# EasyEDA schematic TSOP Module.json

## Sheets
1 Circuit 1: TITLE: Sheet_1; REV: 1.0; Date: 2023-03-30; Sheet: 1/1; Company: Your Company
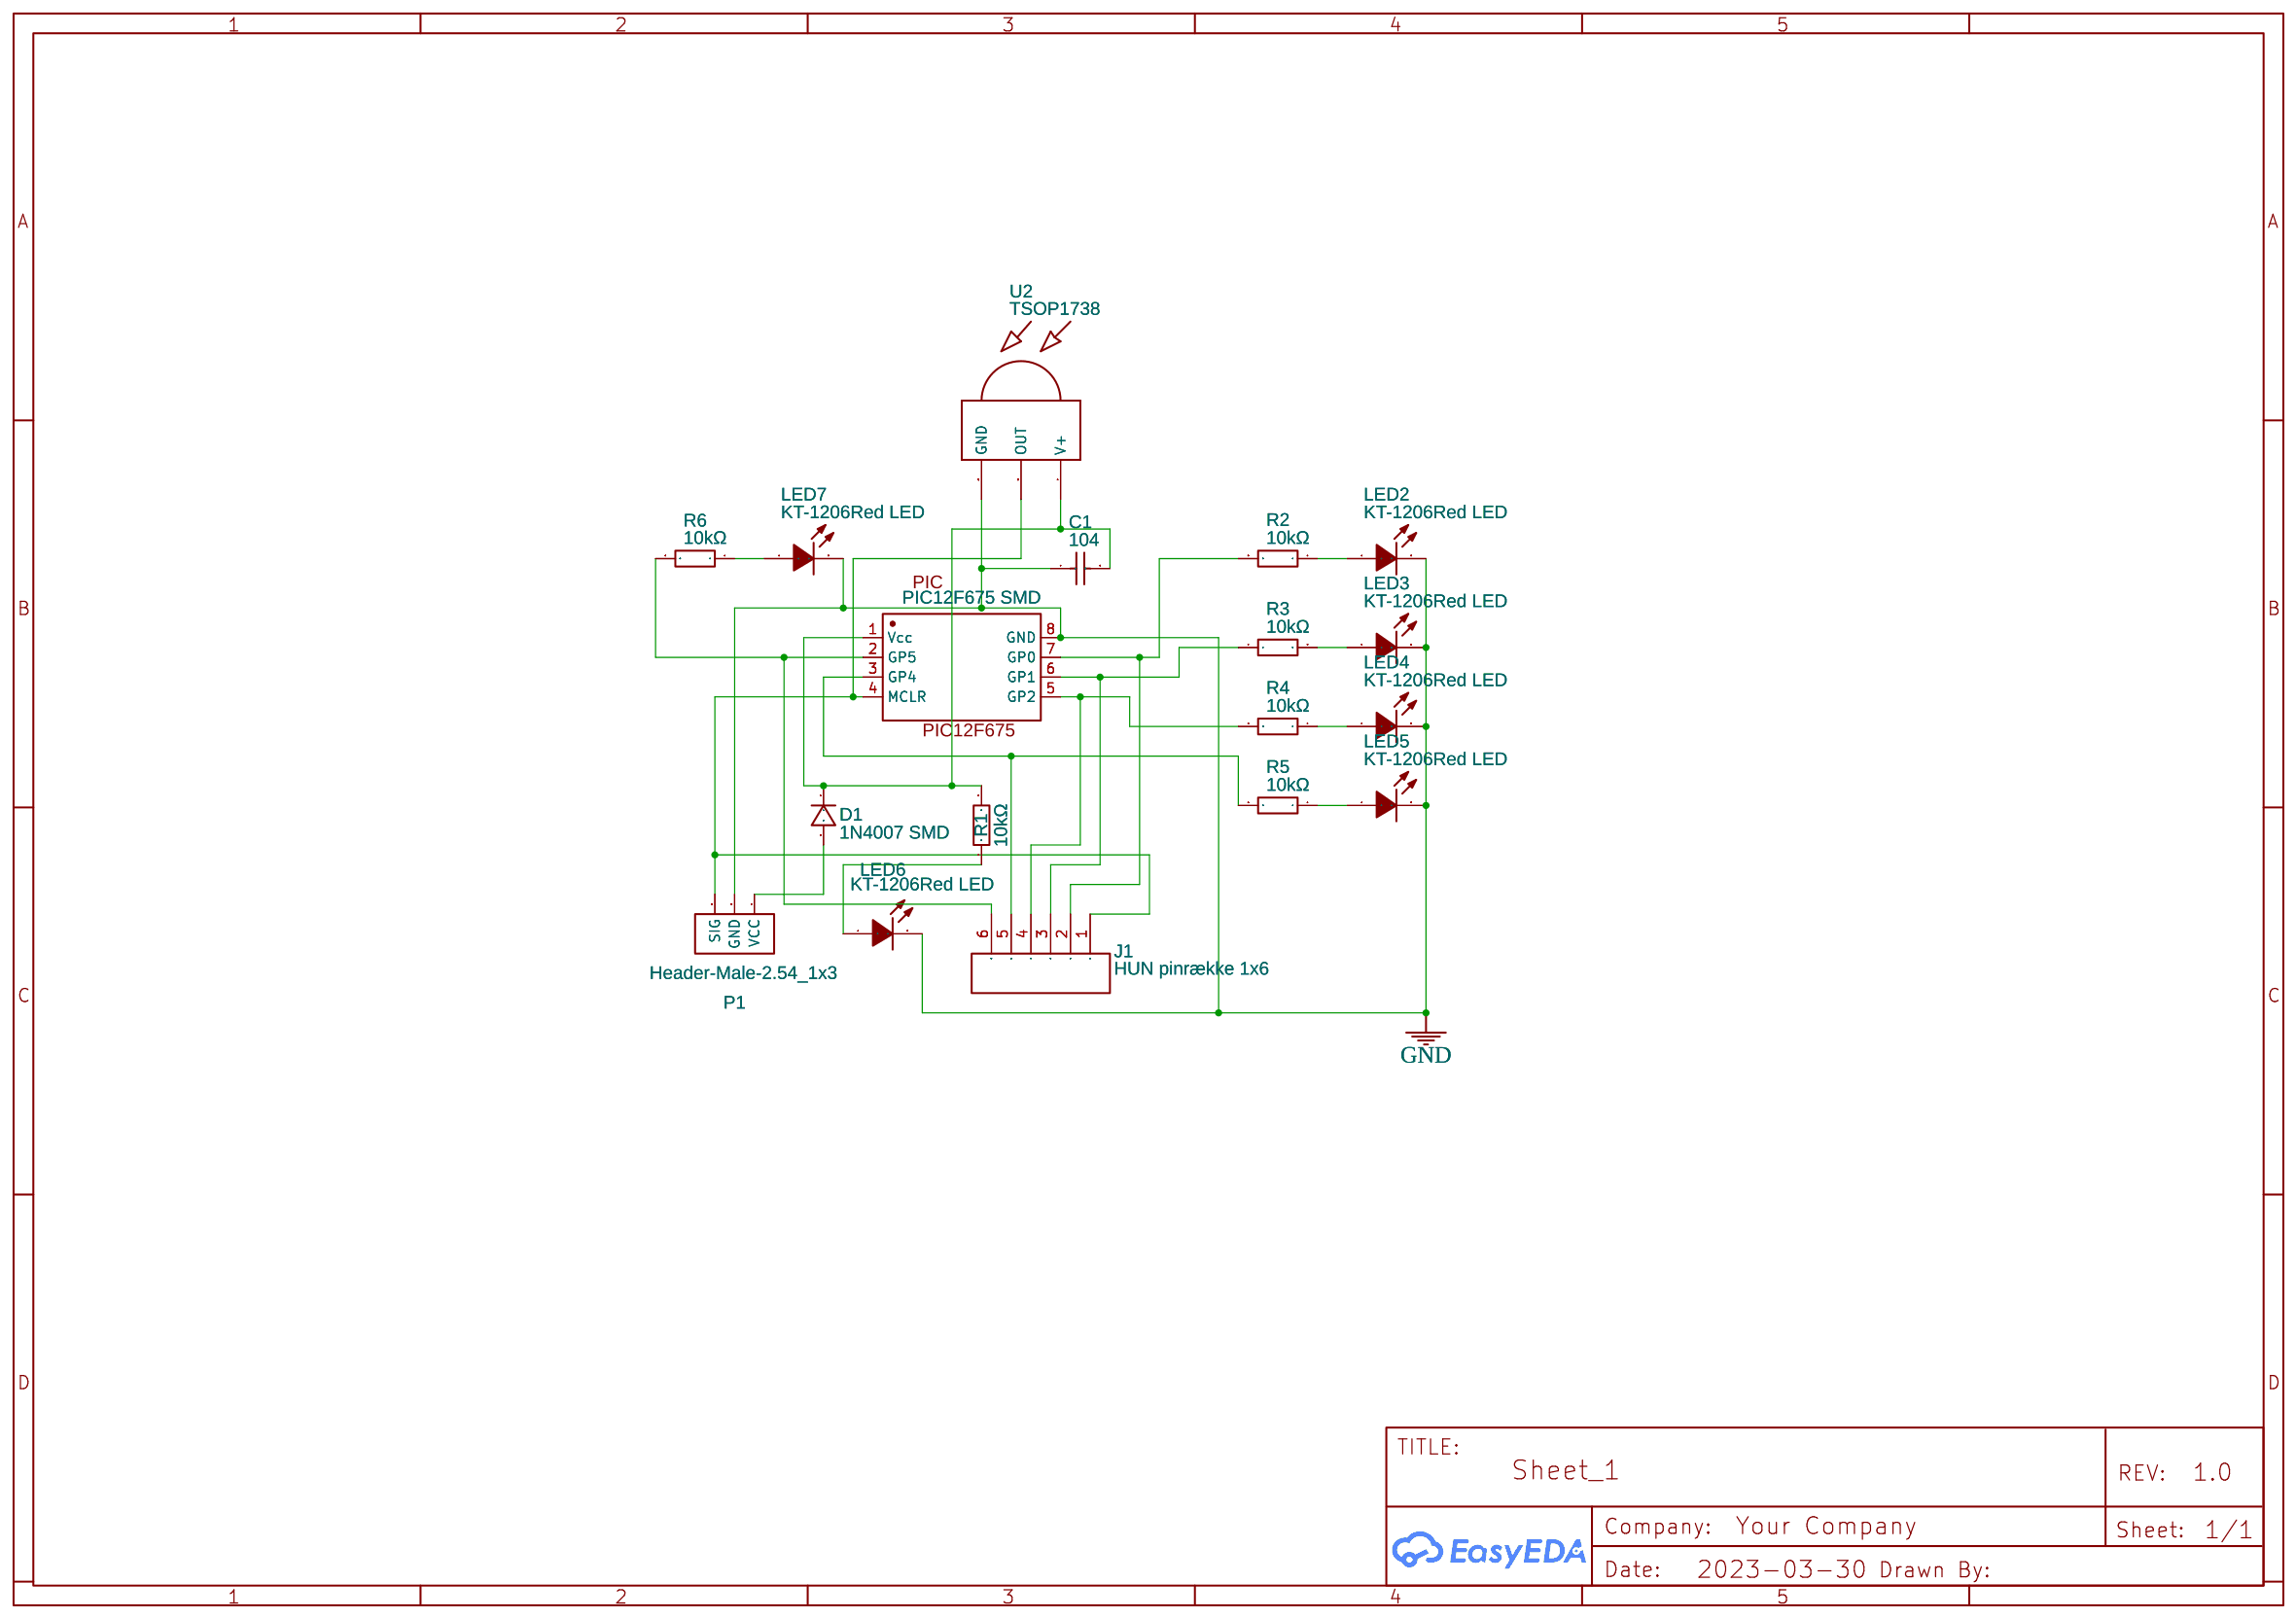
[diagram p0: Circuit 1]
2 Circuit 2: Drawn By: robotic maker
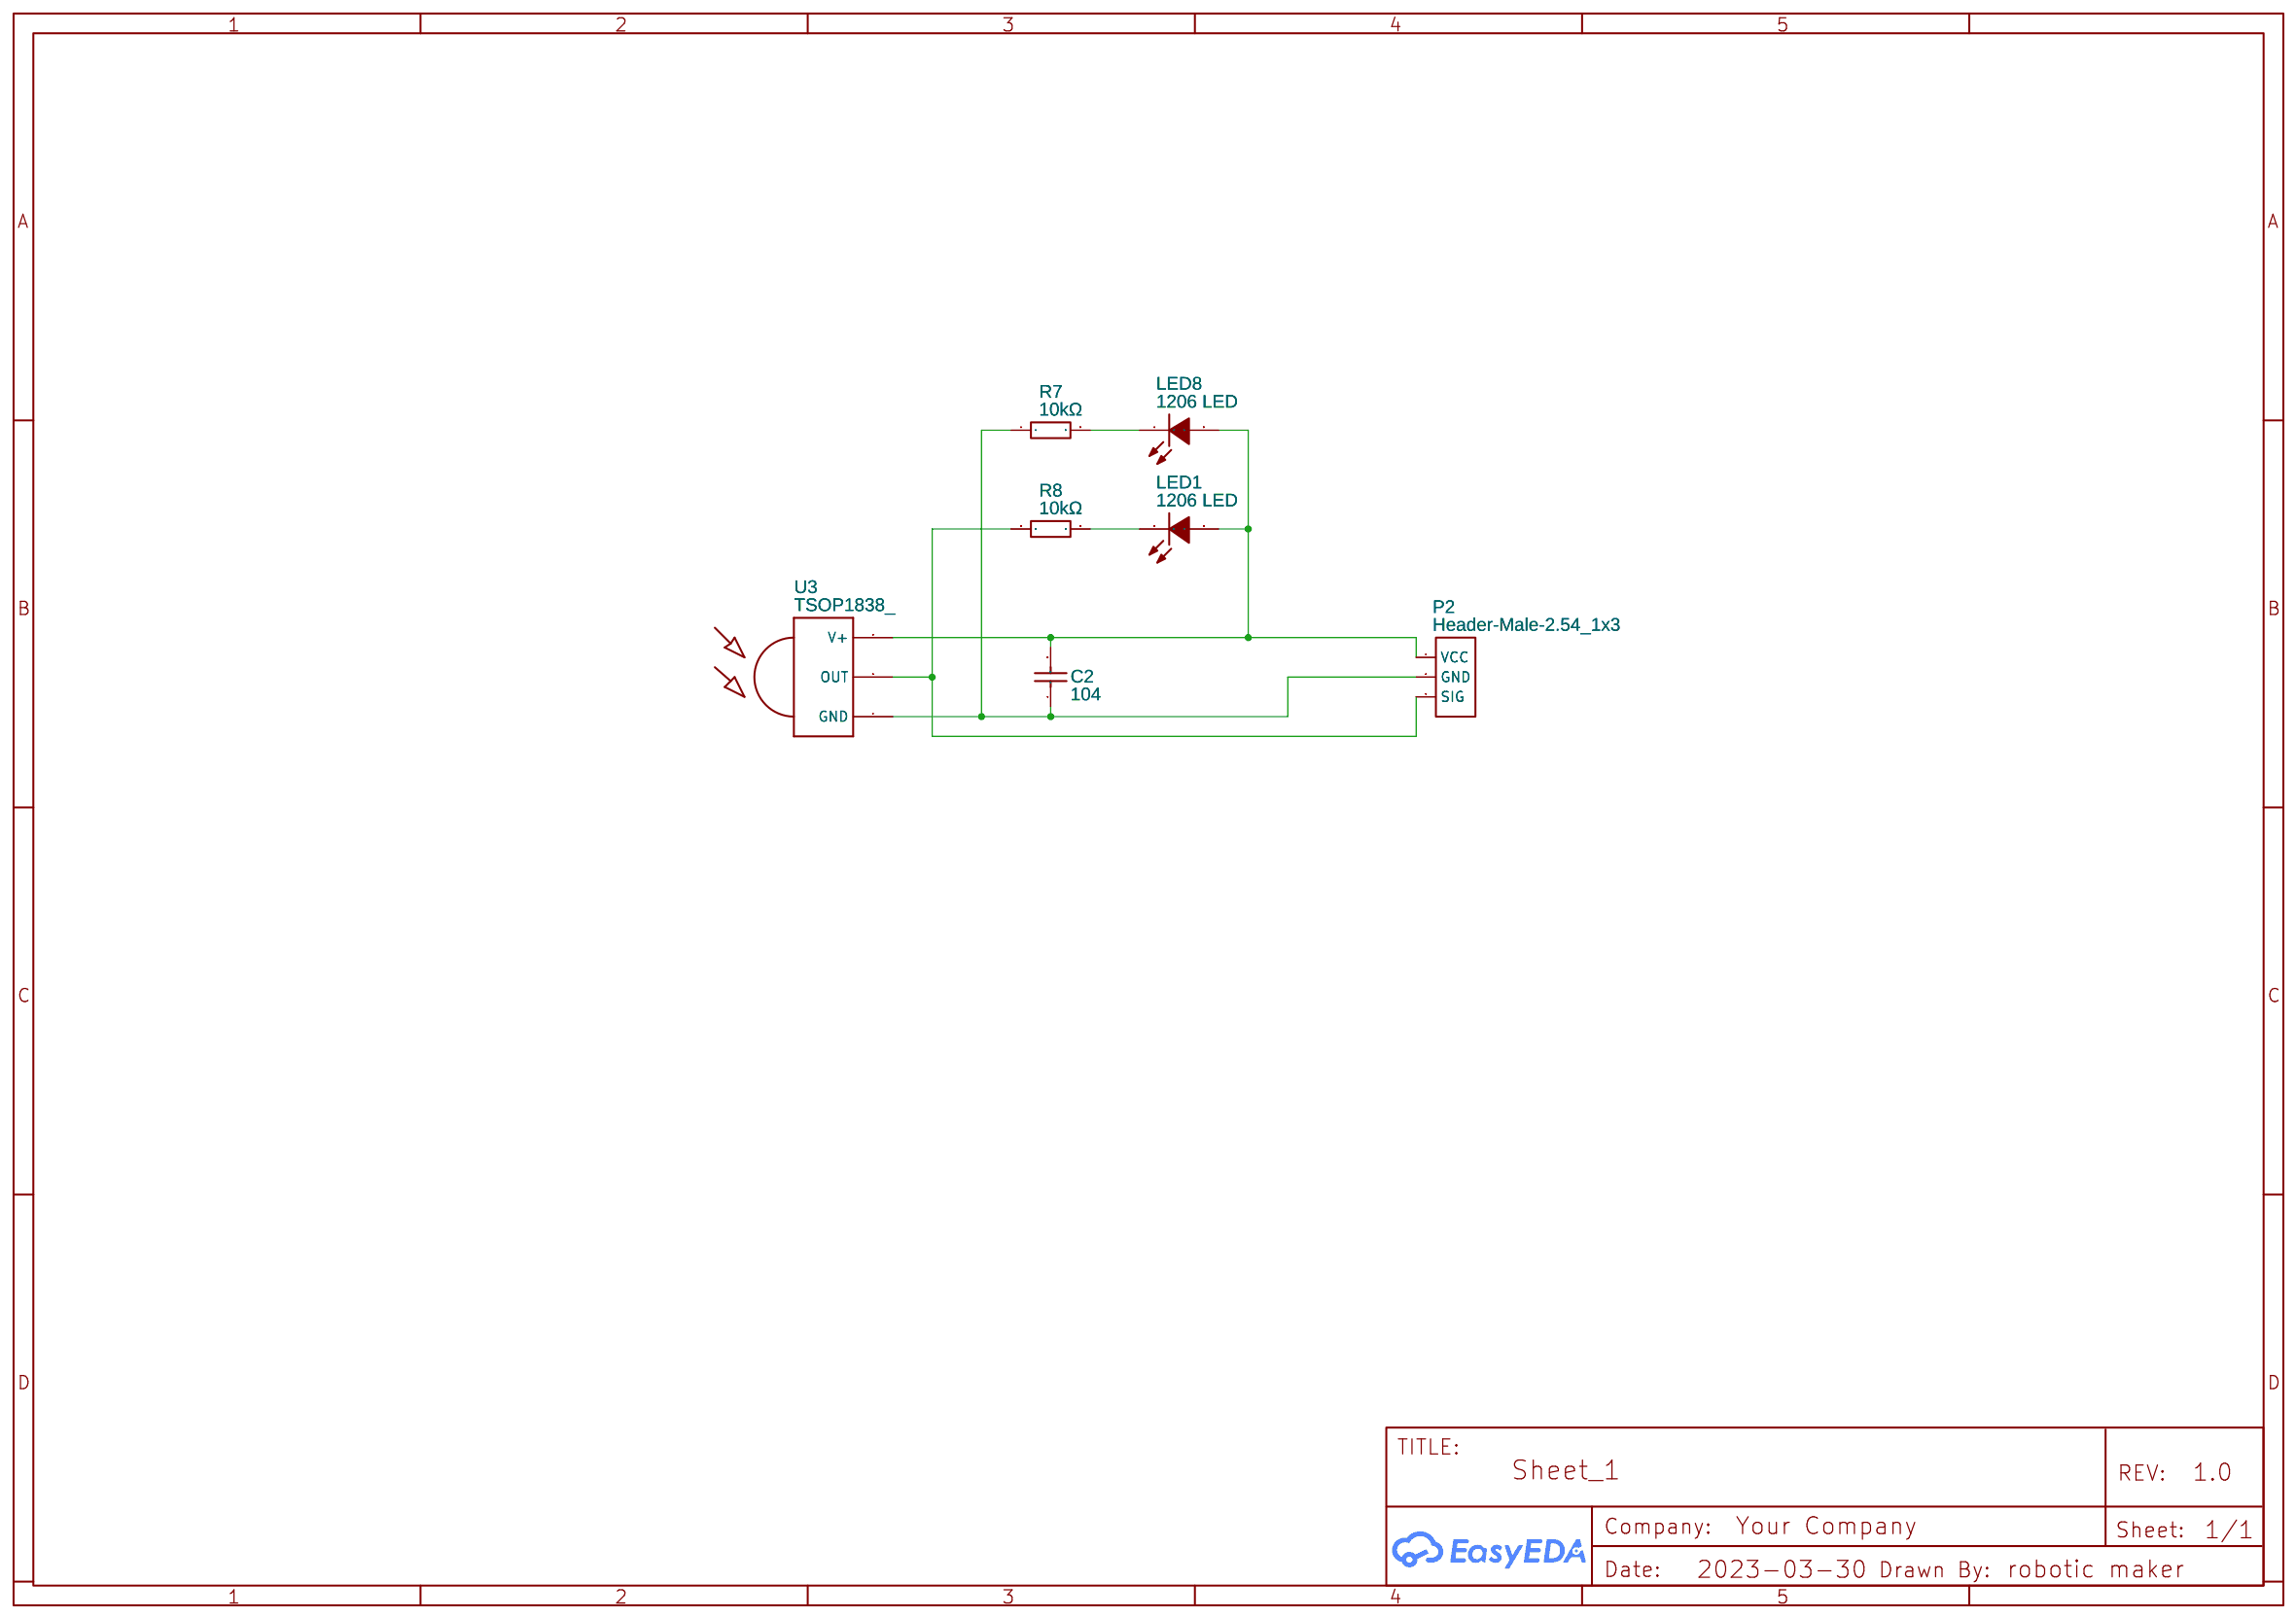
[diagram p1: Circuit 2]

## Parts
sheet Circuit 1
C1  104  [R1206]
D1  1N4007 SMD  [1N4007 SMD]
J1  HUN pinrække 1x6  [1*6_MALE_FEMALE_PIN_HEADER]
LED2  KT-1206Red LED  [LED1206-R-RD]
LED3  KT-1206Red LED  [LED1206-R-RD]
LED4  KT-1206Red LED  [LED1206-R-RD]
LED5  KT-1206Red LED  [LED1206-R-RD]
LED6  KT-1206Red LED  [LED1206-R-RD]
LED7  KT-1206Red LED  [LED1206-R-RD]
P1  Header-Male-2.54_1x3  [HDR-TH_3P-P2.54-V-F]
R1  10kΩ  [R1206]
R2  10kΩ  [R1206]
R3  10kΩ  [R1206]
R4  10kΩ  [R1206]
R5  10kΩ  [R1206]
R6  10kΩ  [R1206]
U1  PIC12F675 SMD  [PIC12F675 SMD]
U2  TSOP1738  [TSOP17XX]
sheet Circuit 2
C2  104  [R1206]
LED1  1206 LED  [LED 1206]
LED8  1206 LED  [LED 1206]
P2  Header-Male-2.54_1x3  [HDR-TH_3P-P2.54-V-F]
R7  10kΩ  [R1206]
R8  10kΩ  [R1206]
U3  TSOP1838_  [SENSOR-TH_TSOP4X_TSOP1838]

## Library data of the parts
C1 C2 = 104PF: Supplier: LCSC; Manufacturer: FH; Manufacturer Part: 100pF250VNP0; Contributor: LCSC; Supplier Part: C27260
D1 = 1N4007 SMD: Supplier: LCSC; Supplier Part: C126233; Manufacturer: SK; Manufacturer Part: 1N4007; Contributor: boonchuan khongsupsinsiri; LCSC Assembly: Yes; SMT Type: Extend
J1 = HUN pinrække 1x6: Manufacturer Part: New SchematicLib; Contributor: madsdahl
LED2-LED7 = KT-1206Red LED: Supplier: LCSC; Manufacturer: KENTO; image: //image.lceda.cn/szlcsc/C49018.jpg; Supplier Part: C49018; LCSC Assembly: Yes; SMT Type: Extend; Contributor: ALI_AHMED
P1 P2 = Header-Female-2.54_1x3: Supplier Part: C146243; Supplier: LCSC; Manufacturer: BOOMELE(博穆精密); Manufacturer Part: 2.54-1*3P母; link: https://datasheet.lcsc.com/szlcsc/Boom-Precision-Elec-2-54mm-1-8P-Straight-Female-header_C27438.pdf; JLCPCB Part Class: Extended Part
R1-R8 = RMC120610K5%N: Supplier: LCSC; Supplier Part: C269752; Manufacturer: Tyohm(幸亚电阻); Resistance (Ohms): 10K; Contributor: LCSC; JLCPCB Part Class: Extended Part
U1 = PIC12F675 SMD: Supplier: Mouser; Contributor: bree9217
U2 = TSOP1738: Contributor: Boleh Tanya
LED1 LED8 = 1206 LED: Supplier Part: 1206; Supplier: LCSC; Manufacturer: KENTO; image: //image.lceda.cn/szlcsc/C49018.jpg; Contributor: ProblemSolver
U3 = TSOP1838_: Contributor: innovatorsguru

## Nets
GND: C1.1 LED2.2(K) LED3.2(K) LED4.2(K) LED5.2(K) LED6.2(K) LED7.2(K) P1.2(GND) U1.8(GND) U2.GND
Net-(C1-2): C1.2 D1.1 R1.2 U1.1(Vcc) U2.V+
Net-(C2-1): C2.1 P2.2(GND) R7.1 U3.1(GND)
Net-(C2-2): C2.2 LED1.2(A) LED8.2(A) P2.1(VCC) U3.3(V+)
Net-(D1-2): D1.2 P1.1(VCC)
Net-(J1-1): J1.1 P1.3(SIG) U1.4(MCLR) U2.OUT
Net-(J1-2): J1.2 R2.2 U1.7(GP0)
Net-(J1-3): J1.3 R3.1 U1.6(GP1)
Net-(J1-4): J1.4 R4.2 U1.5(GP2)
Net-(J1-5): J1.5 R5.2 U1.3(GP4)
Net-(J1-6): J1.6 R6.2 U1.2(GP5)
Net-(LED1-1): LED1.1(K) R8.2
Net-(LED2-1): LED2.1(A) R2.1
Net-(LED3-1): LED3.1(A) R3.2
Net-(LED4-1): LED4.1(A) R4.1
Net-(LED5-1): LED5.1(A) R5.1
Net-(LED6-1): LED6.1(A) R1.1
Net-(LED7-1): LED7.1(A) R6.1
Net-(LED8-1): LED8.1(K) R7.2
Net-(P2-3): P2.3(SIG) R8.1 U3.2(OUT)
